# Altium schematic sheet USBHub.SchDoc
size A4; SheetNumber: 10; SheetTotal: 22
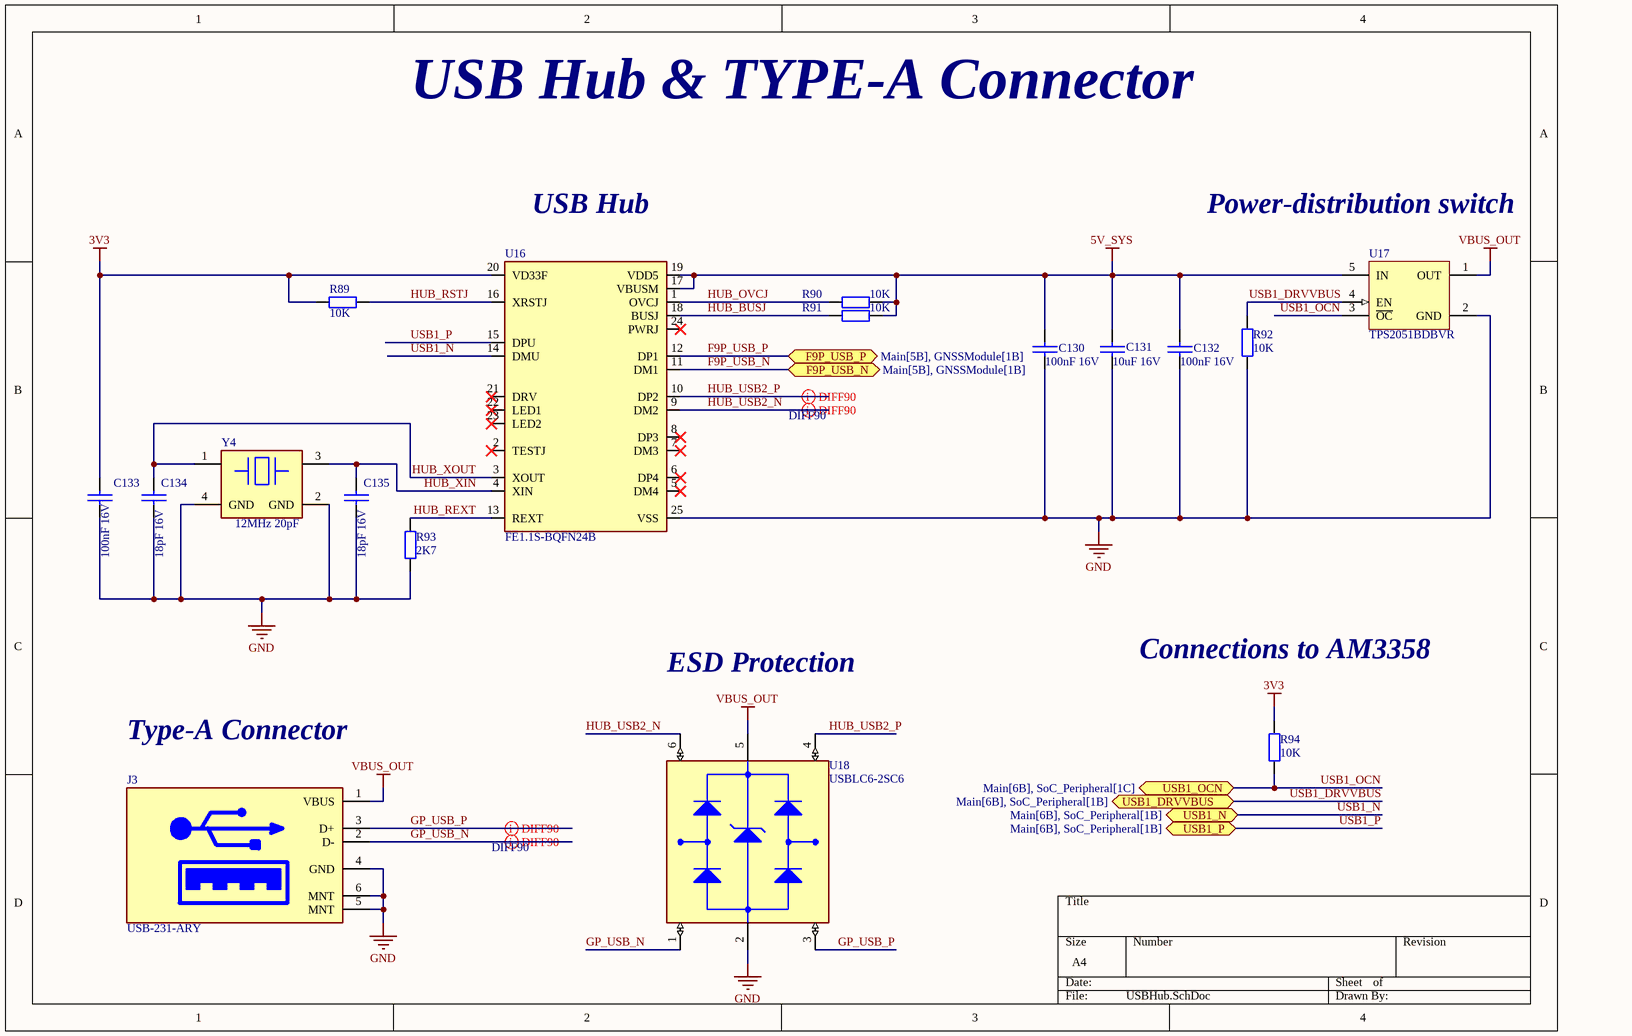
[diagram p0: USBHub.SchDoc]

## Parts
C130  100nF 16V  [C_0402]
C131  10uF 16V  [C_0603]
C132  100nF 16V  [C_0402]
C133  100nF 16V  [C_0402]
C134  18pF 16V  [C_0402]
C135  18pF 16V  [C_0402]
J3  USB-231-ARY  [TYPE-A_W14xD14.45xH7]
R89  10K  [R_0402]
R90  10K  [R_0402]
R91  10K  [R_0402]
R92  10K  [R_0402]
R93  2K7  [R_0402]
R94  10K  [R_0402]
U16  FE1.1S-BQFN24B  [QFN50P400X400X80-25N-D]
U17  TPS2051BDBVR  [DBV0005A_L]
U18  USBLC6-2SC6  [SOT-23-6]
Y4  12MHz 20pF  [CRYSTAL_SMD3225-4P]

## Ports
F9P_USB_N (bidir, see Main[5B], GNSSModule[1B]), F9P_USB_P (bidir, see Main[5B], GNSSModule[1B]), USB1_DRVVBUS (bidir, see Main[6B], SoC_Peripheral[1B]), USB1_N (bidir, see Main[6B], SoC_Peripheral[1B]), USB1_OCN (bidir, see Main[6B], SoC_Peripheral[1C]), USB1_P (bidir, see Main[6B], SoC_Peripheral[1B])

## Nets
3V3: C133.1 R89.2 R94.1 U16.20(VD33F)
5V_SYS: C130.1 C131.1 C132.1 R90.1 R91.1 U16.17(VBUSM) U16.19(VDD5) U17.5(IN)
GND: C130.2 C131.2 C132.2 C133.2 C134.1 C135.1 J3.4(GND) J3.5(MNT) J3.6(MNT) R92.2 R93.1 U16.25(VSS) U17.2(GND) U18.2(GND) Y4.2(GND) Y4.4(GND)
VBUS_OUT: J3.1(VBUS) U17.1(OUT) U18.5(VBUS)
F9P_USB_N: U16.11(DM1) ; port F9P_USB_N
F9P_USB_P: U16.12(DP1) ; port F9P_USB_P
GP_USB_N: J3.2(D-) U18.1(I/O1_IN)
GP_USB_P: J3.3(D+) U18.3(I/O2_IN)
HUB_BUSJ: R91.2 U16.18(BUSJ)
HUB_OVCJ: R90.2 U16.1(OVCJ)
HUB_REXT: R93.2 U16.13(REXT)
HUB_RSTJ: R89.1 U16.16(XRSTJ)
HUB_USB2_N: U16.9(DM2) U18.6(I/O1_OUT)
HUB_USB2_P: U16.10(DP2) U18.4(I/O2_OUT)
HUB_XIN: C135.2 U16.4(XIN) Y4.3(CRYSTAL_2)
HUB_XOUT: C134.2 U16.3(XOUT) Y4.1(CRYSTAL_1)
USB1_DRVVBUS: R92.1 U17.4(EN) ; port USB1_DRVVBUS
USB1_N: U16.14(DMU) ; port USB1_N
USB1_OCN: R94.2 U17.3(~{OC}) ; port USB1_OCN
USB1_P: U16.15(DPU) ; port USB1_P

Not connected (* = marked no-connect by the designer): U16 2(TESTJ)* 5(DM4)* 6(DP4)* 7(DM3)* 8(DP3)* 21(DRV)* 22(LED1)* 23(LED2)* 24(PWRJ)*

## Layout directives
differential pair; differential pair class DIFF90: GP_USB_N, GP_USB_P, HUB_USB2_N, HUB_USB2_P

## Notes on the sheet
- USB Hub & TYPE-A Connector
- USB Hub
- Power-distribution switch
- ESD Protection
- Connections to AM3358
- Type-A Connector

## Library data of the parts
C130 C132-C135 = C_0402: Capacitor 0402 SMD
C131 = C_0603: Capacitor 0603 SMD
J3 = USB-231-ARY: Type-A 1.5A USB 2.0 1 Bend-in 4P Female -20℃~+70℃  Plugin USB Connectors ROHS; Manufacturer: XUNPU; Manufacturer Part Number: USB-231-ARY; Datasheet Link: https://www.lcsc.com/datasheet/lcsc_datasheet_2409302332_XUNPU-USB-231-ARY_C720525.pdf
R89-R94 = R_0402: Resistor 0402 SMD
U16 = FE1.1S-BQFN24B: USB 2.0 4-PORT HuB CONTROLlER; Manufacturer: Terminus Tech; Manufacturer Part Number: FE1.1S-BQFN24B; Datasheet Link: https://taoic.oss-cn-hangzhou.aliyuncs.com/7545/product/johnma_1627012225000.pdf
U17 = CMP-2000-07277-1: Current-Limited, Power-Distribution Switch, 2.7 to 5.5 V, -40 to 85 degC, 5-Pin SOT-23 (DBV), Green (RoHS & no Sb/Br), Tape and Reel; Manufacturer: TexasInstruments; Number of Outputs: 1Output; Operating Supply Voltage: 2.7Vto5.5V; Supply Voltage - Min: 2.7V; Supply Voltage - Max: 5.5V; Current Limit: 1A; Development Kit: TPS2051BEVM; Output Current: 500mA; On Resistance - Max: 70mOhms; Package Version: 4073253-4/N, 12/2014; Mounting Technology: SurfaceMount; Packaging: Reel; Package / Case: SOT-23-5; Maximum Operating Temperature: +85C; Package Description: 5-Pin Small Outline Transistor, Body 2.9 x 1.6 mm, Pitch 0.95 mm; Type: HighSide; Product: USBCurrentLimitedPowerSwitches; Minimum Operating Temperature: -40C; Manufacturer URL: http://www.ti.com/; Factory Pack Quantity: 3000; Mounting Style: SMD/SMT; Brand: TexasInstruments; Package Reference: DBV5; Package URL: http://www.ti.com/lit/ml/mpds018l/mpds018l.pdf; Datasheet URL: http://www.ti.com/general/docs/lit/getliterature.tsp?genericPartNumber=TPS2051B&fileType=pdf; Product Category: PowerSwitchICs-PowerDistribution; Series: TPS2051B; Datasheet Version: Rev. L, 06/2011; RoHS: Details
U18 = USBLC6-2SC6: 6A 12V 150W 6V Unidirectional 5V SOT-23-6 ESD and Surge Protection (TVS/ESD) ROHS; Manufacturer: STMicroelectronics; Manufacturer Part Number: USBLC6-2SC6; Datasheet Link: https://www.st.com/resource/en/datasheet/usblc6-2.pdf
Y4 = X322512MSB4SI: 12MHz Surface Mount Crystal 20pF ±10ppm ±20ppm SMD3225-4P Crystals ROHS; Manufacturer: YXC Crystal Oscillators; Manufacturer Part Number: X322512MSB4SI; Datasheet Link: https://www.lcsc.com/datasheet/lcsc_datasheet_2411121006_YXC-Crystal-Oscillators-X322524MSB4SI_C15643.pdf